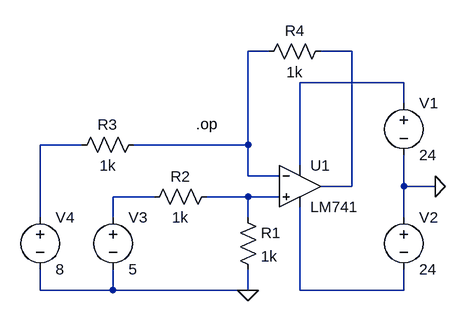
[diagram p0: schematic 8-sub.asc]
8-sub.asc, the LTspice schematic file:
Version 4.1
SHEET 1 880 680
WIRE 176 -32 144 -32
WIRE 304 -32 256 -32
WIRE 384 16 224 16
WIRE 384 48 384 16
WIRE -112 112 -176 112
WIRE 144 112 144 -32
WIRE 144 112 -32 112
WIRE 224 144 224 16
WIRE 144 160 144 112
WIRE 192 160 144 160
WIRE 304 176 304 -32
WIRE 304 176 256 176
WIRE 384 176 384 128
WIRE 432 176 384 176
WIRE 0 192 -64 192
WIRE 144 192 80 192
WIRE 192 192 144 192
WIRE -176 224 -176 112
WIRE -64 224 -64 192
WIRE 144 224 144 192
WIRE 384 224 384 176
WIRE -176 336 -176 304
WIRE -64 336 -64 304
WIRE -64 336 -176 336
WIRE 144 336 -64 336
WIRE 144 336 144 304
WIRE 224 336 224 208
WIRE 384 336 384 304
WIRE 384 336 224 336
FLAG 432 176 0
FLAG 144 336 0
SYMBOL LM741 224 112 R0
SYMATTR InstName U1
SYMBOL voltage 384 32 R0
SYMATTR InstName V1
SYMATTR Value 24
SYMBOL voltage 384 208 R0
SYMATTR InstName V2
SYMATTR Value 24
SYMBOL res 128 208 R0
SYMATTR InstName R1
SYMATTR Value 1k
SYMBOL voltage -64 208 R0
SYMATTR InstName V3
SYMATTR Value 5
SYMBOL voltage -176 208 R0
SYMATTR InstName V4
SYMATTR Value 8
SYMBOL res 96 176 R90
WINDOW 0 0 56 VBottom 2
WINDOW 3 32 56 VTop 2
SYMATTR InstName R2
SYMATTR Value 1k
SYMBOL res -16 96 R90
WINDOW 0 0 56 VBottom 2
WINDOW 3 32 56 VTop 2
SYMATTR InstName R3
SYMATTR Value 1k
SYMBOL res 272 -48 R90
WINDOW 0 0 56 VBottom 2
WINDOW 3 32 56 VTop 2
SYMATTR InstName R4
SYMATTR Value 1k
TEXT 64 80 Left 2 !.op

The netlist it stands for:
* 8-sub.asc
X§U1 N006 N001 N003 N007 N002 LM741  ; pins In+ In- V+ V- OUT
V1 N003 0 24
V2 0 N007 24
R1 N006 0 1k
V3 N005 0 5
V4 N004 0 8
R2 N006 N005 1k
R3 N001 N004 1k
R4 N002 N001 1k
.op
.lib LM741.lib
.backanno
.end